# EAGLE design SpectraPCB (EAGLE 8.1.0)
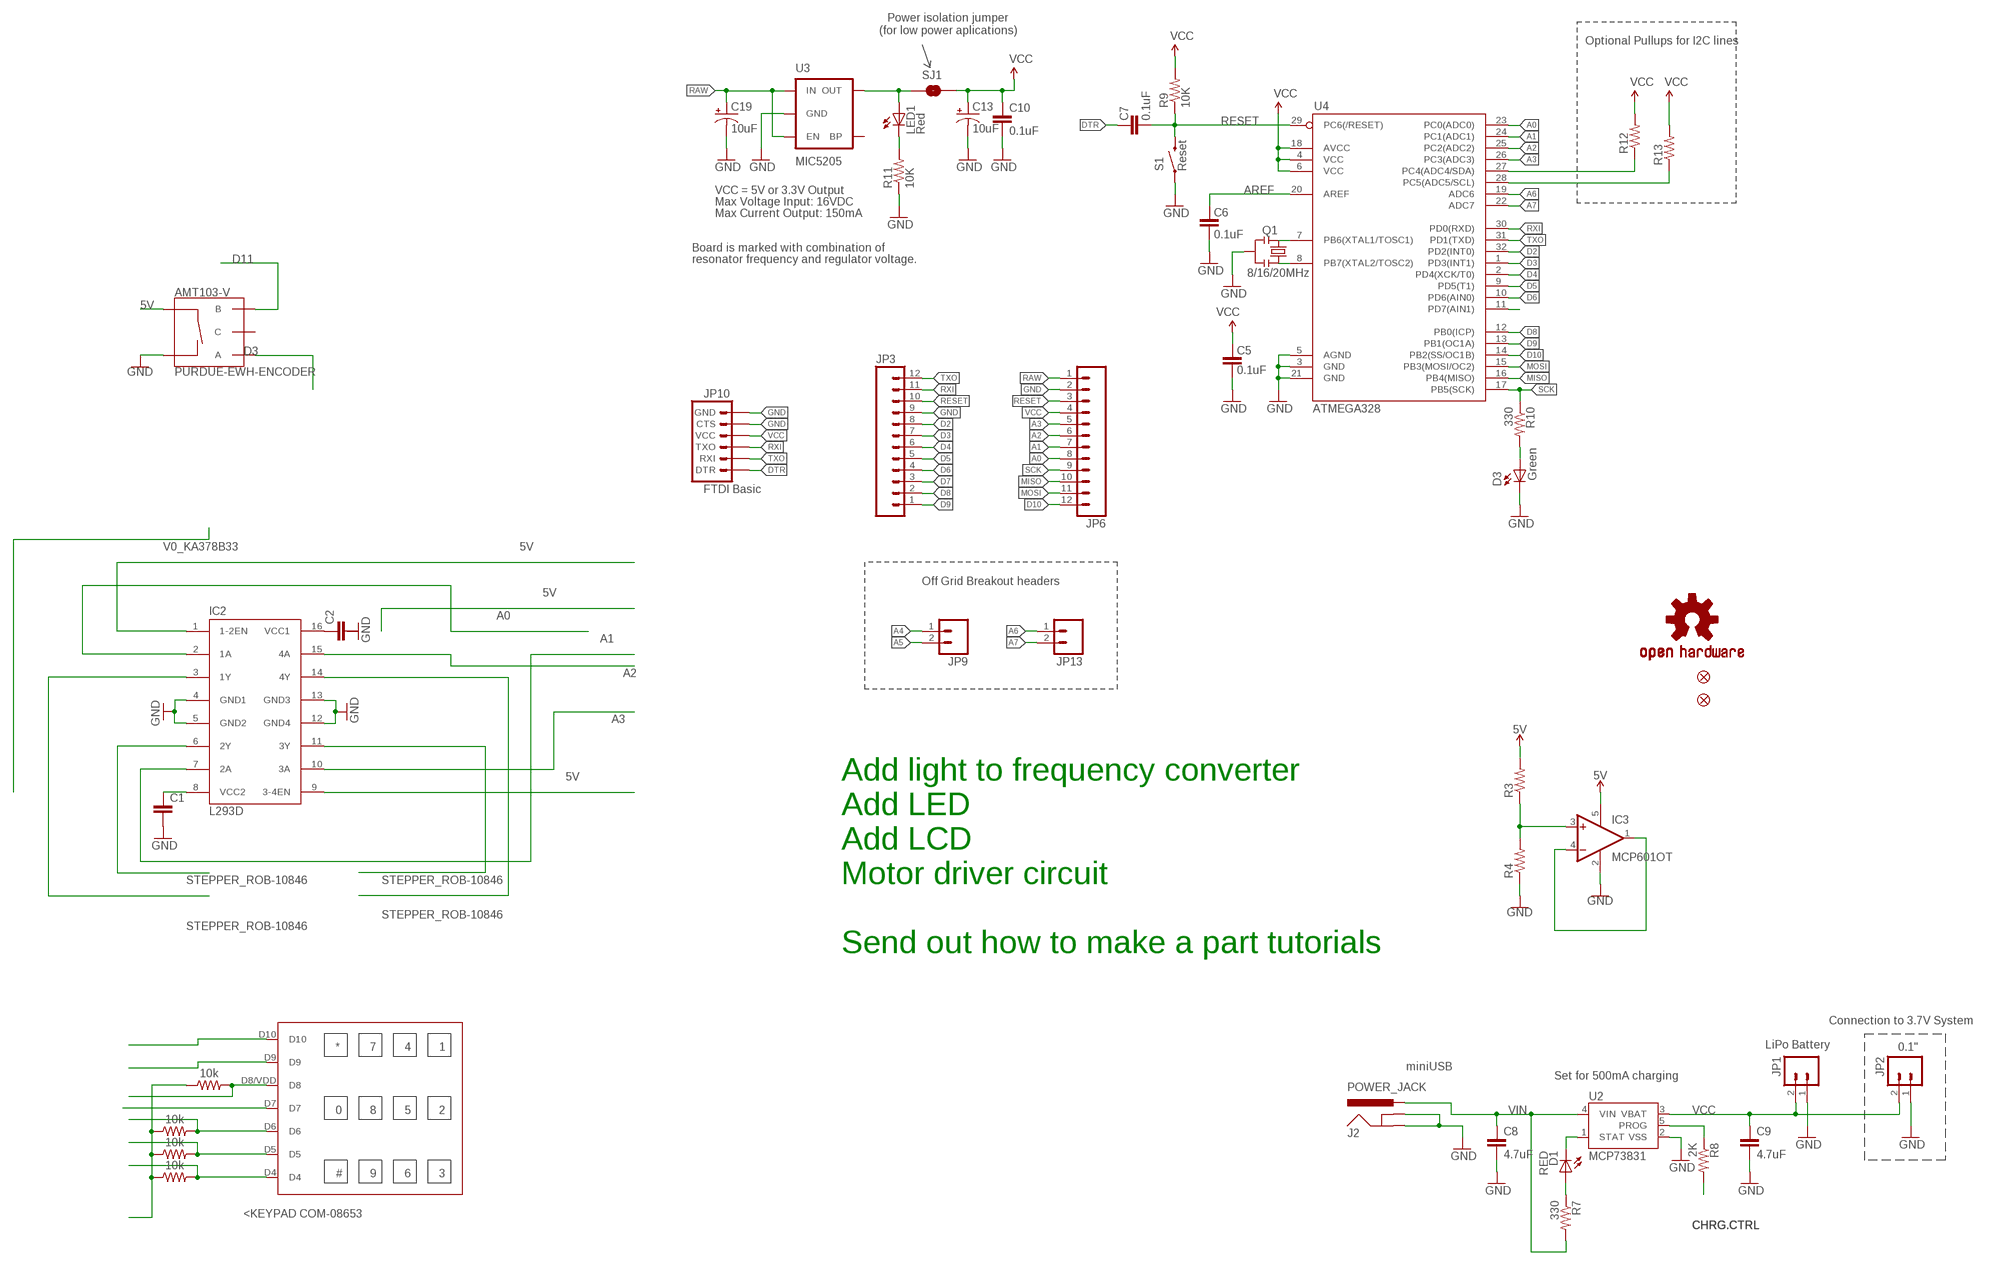
[diagram p0: schematic, sheet 1]

## Parts
AMT103-V  PURDUE-EWH-ENCODER  [PURDUE-EWH-ENCODER]
C1  C-EUC0603  [C0603]
C2  C-EUC0402  [C0402]
C5  0.1uF  CAP0603-CAP  [0603-CAP]
C6  0.1uF  CAP0603-CAP  [0603-CAP]
C7  0.1uF  CAP0603-CAP  [0603-CAP]
C8  4.7uF  CAP0402-CAP  [0402-CAP]
C9  4.7uF  CAP0402-CAP  [0402-CAP]
C10  0.1uF  CAP0603-CAP  [0603-CAP]
C13  10uF  CAP_POL1206  [EIA3216]
C19  10uF  CAP_POL1206  [EIA3216]
D1  RED  LED0603  [LED-0603]
D3  Green  LED  [0603-LED-ALT1]
IC2  L293D  [DIL16]
IC3  MCP601OT  [SOT23-5]
J2  POWER_JACK  [POWER_JACK_PTH]
JP1  LiPo Battery  M02-JST-2MM-SMT  [JST-2-SMD]
JP2  M02PTH  [1X02]
JP3  M12PTH  [1X12]
JP6  M12PTH  [1X12]
JP9  M02PTH  [1X02]
JP10  FTDI Basic  ARDUINO_SERIAL_PROGRAMPTH  [1X06]
JP11  FIDUCIALUFIDUCIAL  [MICRO-FIDUCIAL]
JP12  FIDUCIALUFIDUCIAL  [MICRO-FIDUCIAL]
JP13  M02PTH  [1X02]
LED1  Red  LED  [0603-LED-ALT1]
Q1  8/16/20MHz  RESONATOR1:1  [RESONATOR-SMD-1:1]
R1  10k  10KOHM-0603-1/10W-1%  [0603]
R2  10k  10KOHM-0603-1/10W-1%  [0603]
R3  R-US_R0402  [R0402]
R4  R-US_R0402  [R0402]
R5  10k  10KOHM-0603-1/10W-1%  [0603]
R6  10k  10KOHM-0603-1/10W-1%  [0603]
R7  330  RESISTOR0402-RES  [0402-RES]
R8  2K  RESISTOR0402-RES  [0402-RES]
R9  10K  RESISTOR0603-RES  [0603-RES]
R10  330  RESISTOR0603-RES  [0603-RES]
R11  10K  RESISTOR0603-RES  [0603-RES]
R12  RESISTOR0603-RES  [0603-RES]
R13  RESISTOR0603-RES  [0603-RES]
S1  Reset  SWITCH-MOMENTARY-2SMD-ALT01  [TACTILE-SWITCH-SMD-ALT01]
SJ1  SOLDERJUMPERNC  [SJ_2S]
U2  MCP73831  [SOT23-5]
U3  MIC5205  V_REG_LDOSMD  [SOT23-5]
U4  ATMEGA328  ATMEGA168  [TQFP32-08]
U$1  EWH_KEYPAD  [EWH_KEYPAD]
U$3  OSHW-LOGOS  [OSHW-LOGO-S]

## Nets
5V: AMT103-V.SW+ IC2.1(1-2EN) IC2.9(3-4EN) IC3.5(V+) R3.2
A0: IC2.2(1A) JP6.8 U4.23(PC0(ADC0))
A1: IC2.7(2A) JP6.7 U4.24(PC1(ADC1))
A2: IC2.15(4A) JP6.6 U4.25(PC2(ADC2))
A3: IC2.10(3A) JP6.5 U4.26(PC3(ADC3))
A4: JP9.1 R12.1 U4.27(PC4(ADC4/SDA))
A5: JP9.2 R13.1 U4.28(PC5(ADC5/SCL))
A6: JP13.1 U4.19(ADC6)
A7: JP13.2 U4.22(ADC7)
AREF: C6.2 U4.20(AREF)
CHRG.CTRL: R8.2 U4.11(PD7(AIN1))
D2: JP3.8 U4.32(PD2(INT0))
D3: AMT103-V.A JP3.7 U4.1(PD3(INT1))
D4: JP3.6 U4.2(PD4(XCK/T0))
D5: JP3.5 U4.9(PD5(T1))
D6: JP3.4 U4.10(PD6(AIN0))
D7: JP3.3
D8: JP3.2 U4.12(PB0(ICP))
D9: JP3.1 U4.13(PB1(OC1A))
D10: JP6.12 U4.14(PB2(SS/OC1B))
D11: AMT103-V.B
DTR: C7.2 JP10.1(DTR)
GND: AMT103-V.SW- C1.2 C5.1 C6.1 C8.2 C9.2 C10.2 C13.C(-) C19.C(-) D3.C IC2.4(GND1) IC2.5(GND2) IC2.12(GND4) IC2.13(GND3) IC3.2(V-) J2.GND J2.GNDBREAK JP1.1 JP2.1 JP3.9 JP6.2 JP10.5(CTS) JP10.6(GND) Q1.2 R4.1 R11.1 S1.1 S1.2 U2.2(VSS) U3.2(GND) U4.3(GND) U4.5(AGND) U4.21(GND)
MISO: JP6.10 U4.16(PB4(MISO))
MOSI: JP6.11 U4.15(PB3(MOSI/OC2))
N$1: Q1.3 U4.8(PB7(XTAL2/TOSC2))
N$2: C1.1 IC2.8(VCC2)
N$3: IC3.3(+IN) R3.1 R4.2
N$4: Q1.1 U4.7(PB6(XTAL1/TOSC1))
N$5: LED1.A SJ1.1 U3.5(OUT)
N$6: LED1.C R11.2
N$7: D3.A R10.2
N$8: C2.1 IC2.16(VCC1)
N$9: U$1.D10
N$10: U$1.D9
N$11: R1.2 U$1.D8/VDD(D8)
N$12: U$1.D7
N$13: R2.2 U$1.D6
N$14: R6.2 U$1.D4
N$15: R1.1 R2.1 R5.1 R6.1
N$16: R5.2 U$1.D5
N$17: D1.A R7.1
N$18: IC3.1(OUT) IC3.4(-IN)
PROG1: R8.1 U2.5(PROG)
RAW [vcc]: C19.A(+) JP6.1 U3.1(IN) U3.3(EN)
RESET: C7.1 JP3.10 JP6.3 R9.1 S1.3 S1.4 U4.29(PC6(/RESET))
RXI: JP3.11 JP10.3(TXO) U4.30(PD0(RXD))
SCK: JP6.9 R10.1 U4.17(PB5(SCK))
STAT1: D1.C U2.1(STAT)
STEPPER_ROB-10846: IC2.3(1Y) IC2.6(2Y) IC2.11(3Y) IC2.14(4Y)
TXO: JP3.12 JP10.2(RXI) U4.31(PD1(TXD))
VCC: C5.2 C9.1 C10.1 C13.A(+) JP1.2 JP2.2 JP6.4 JP10.4(VCC) R9.2 R12.2 R13.2 SJ1.2 U2.3(VBAT) U4.4(VCC) U4.6(VCC) U4.18(AVCC)
VIN: C8.1 J2.PWR R7.2 U2.4(VIN)
Unconnected: AMT103-V.C C2.2 U3.4(BP)

## Notes on the sheet
- Power isolation jumper
- (for low power aplications)
- Optional Pullups for I2C lines
- VCC = 5V or 3.3V Output
- Max Voltage Input: 16VDC
- Max Current Output: 150mA
- Board is marked with combination of
- resonator frequency and regulator voltage.
- Off Grid Breakout headers
- Add light to frequency converter
  Add LED
  Add LCD
  Motor driver circuit
  
  Send out how to make a part tutorials
- Connection to 3.7V System
- * | 7 | 4 | 1 | 0.1"
- miniUSB
- Set for 500mA charging
- 0 | 8 | 5 | 2
- # | 9 | 6 | 3
- <KEYPAD COM-08653

## Library data of the parts
AMT103-V = Purdue-EWH-Encoder:PURDUE-EWH-ENCODER: Rotary Encoder w/ Select Switch Encoders rotate similarly to potentiometers, but they’re different from potentiometers in that an encoder has full rotation without limits. They output gray code so that you can tell how much and in which direction the encoder has been turned. This encoder includes a push-down select switch built into the shaft. SparkFun Products Rotary Encoder <https://www.sparkfun.com/products/9117> (COM-09117); SF_SKU: COM-09117
C1 C2 = resistor:C-EU: CAPACITOR, European symbol
C5-C10 = SparkFun:CAP: Capacitor Standard 0603 ceramic capacitor, and 0.1" leaded capacitor.
C13 C19 = SparkFun:CAP_POL: Capacitor Polarized These are standard SMD and PTH capacitors. Normally 10uF, 47uF, and 100uF in electrolytic and tantalum varieties. Always verify the external diameter of the through hole cap, it varies with capacity, voltage, and manufacturer. The EIA devices should be standard.
D1 = SparkFun:LED: LEDs Standard schematic elements and footprints for 5mm, 3mm, 1206, and 0603 sized LEDs. 5mm - Spark Fun Electronics SKU : COM-00529 (and others)
D3 LED1 = Testing:LED: LEDs Standard schematic elements and footprints for 5mm, 3mm, 1206, and 0603 sized LEDs. 5mm - Spark Fun Electronics SKU : COM-00529 (and others)
IC2 = st-microelectronics:L293D: PUSH-PULL 4 CHANNEL DRIVER; MPN: L293D; OC_FARNELL: 9589619; OC_NEWARK: 56P8249
IC3 = CalvEngIO-AnalogIC:MCP601: Single Op Amp 2.7V to 6.0V Single Supply CMOS Source: http://ww1.microchip.com/downloads/en/DeviceDoc/21314g.pdf
J2 = SparkFun-Connectors:POWER_JACK: Power Jack Connector This is the standard 5.5mm barrel jack for power. The PTH is the most common, proven, reliable, footprint. The Slot footprint only works if the mill layer is transmitted to the PCB fab house so be warned. Here are the connectors we sell at SparkFun: DC Barrel Power Jack/Connector <https://www.sparkfun.com/products/119> (PRT-00119) DC Barrel Power Jack/Connector (SMD) <https://www.sparkfun.com/products/12748> (PRT-12748) DC Barrel Jack Adapter - Breadboard Compatible <https://www.sparkfun.com/products/10811> (PRT-10811) It is used on this SparkFun product (and many, many others): SparkFun RedBoard - Programmed with Arduino <https://www.sparkfun.com/products/12757> (DEV-12757) Also, if you need a mating power supply or connector, please check these out: Wall Adapter Power Supply - 9VDC 650mA <https://www.sparkfun.com/products/298> (TOL-00298) DC Barrel Jack Adapter - Male <https://www.sparkfun.com/products/10287> (PRT-10287); PROD_ID: CONN-08197
JP1 JP2 JP9 JP13 = SparkFun:M02: Header 2 Standard 2-pin 0.1" header. Use with straight break away headers (SKU : PRT-00116), right angle break away headers (PRT-00553), swiss pins (PRT-00743), machine pins (PRT-00117), and female headers (PRT-00115). Molex polarized connector foot print use with SKU : PRT-08233 with associated crimp pins and housings.
JP3 JP6 = SparkFun:M12: Header 12 Standard 12-pin 0.1" header. Use with straight break away headers (SKU : PRT-00116), right angle break away headers (PRT-00553), swiss pins (PRT-00743), machine pins (PRT-00117), and female headers (PRT-00115).
JP10 = SparkFun:ARDUINO_SERIAL_PROGRAM
JP11 JP12 = SparkFun:FIDUCIAL: Fiducial Alignment Points Various fiducial points for machine vision alignment.
Q1 = Testing:RESONATOR: Resonator Small SMD resonator. This is the itty bitty 10/20MHz resonators with built in caps. CSTCE10M0G55 and CSTCE20M0V53. Footprint for SMD has been used in SFE production for years, and does work okay. 1:1 is an attempt to get larger fillets on the sides so it will be easier to inspect these solders in our AOI machine. The pads have been minimized to match the actual metal under the resonator. To see this relation, it includes an image import of the bottom side of the component. Imported to scale on layer 200.
R1 R2 R5 R6 = SparkFun-Resistors:10KOHM: 10kΩ resistor A resistor is a passive two-terminal electrical component that implements electrical resistance as a circuit element. Resistors act to reduce current flow, and, at the same time, act to lower voltage levels within circuits. - Wikipedia; PROD_ID: RES-00824
R3 R4 = resistor:R-US_: RESISTOR, American symbol
R7-R13 = SparkFun:RESISTOR: Resistor Basic schematic elements and footprints for 0603, 1206, and PTH resistors.
S1 = Testing:SWITCH-MOMENTARY-2: Various NO switches- pushbuttons, reed, etc
SJ1 = SparkFun-Passives:SOLDERJUMPER: Solder Jumper Standard SMD solder jumper. Used to automate production. Two varients : Normally Open and Normally Closed are the same, but have different paste layers. NC will have a large amount of paste and should jumper during reflow.
U2 = SparkFun:MCP73831: Microchip's MCP73831 Miniature single cell, fully integrated Li-Ion, Li-polymer charge management controller http://ww1.microchip.com/downloads/en/DeviceDoc/21984a.pdf
U3 = SparkFun:V_REG_LDO: Voltage Regulator LDO Standard 150mA LDO voltage regulator in SOT-23 layout. Micrel part MIC5205. BP (by-pass) pin is used to lower output noise with 470pF cap.
U4 = SparkFun:ATMEGA168
U$1 = Purdue-EWH-Keypad:EWH_KEYPAD
U$3 = SparkFun:OSHW-LOGO: Open Source Hardware Logo This logo indicates the piece of hardware it is found on incorporates a OSHW license and/or adheres to the definition of open source hardware found here: http://freedomdefined.org/OSHW

## Net classes
1 vcc: width 0.254 mm

## Board
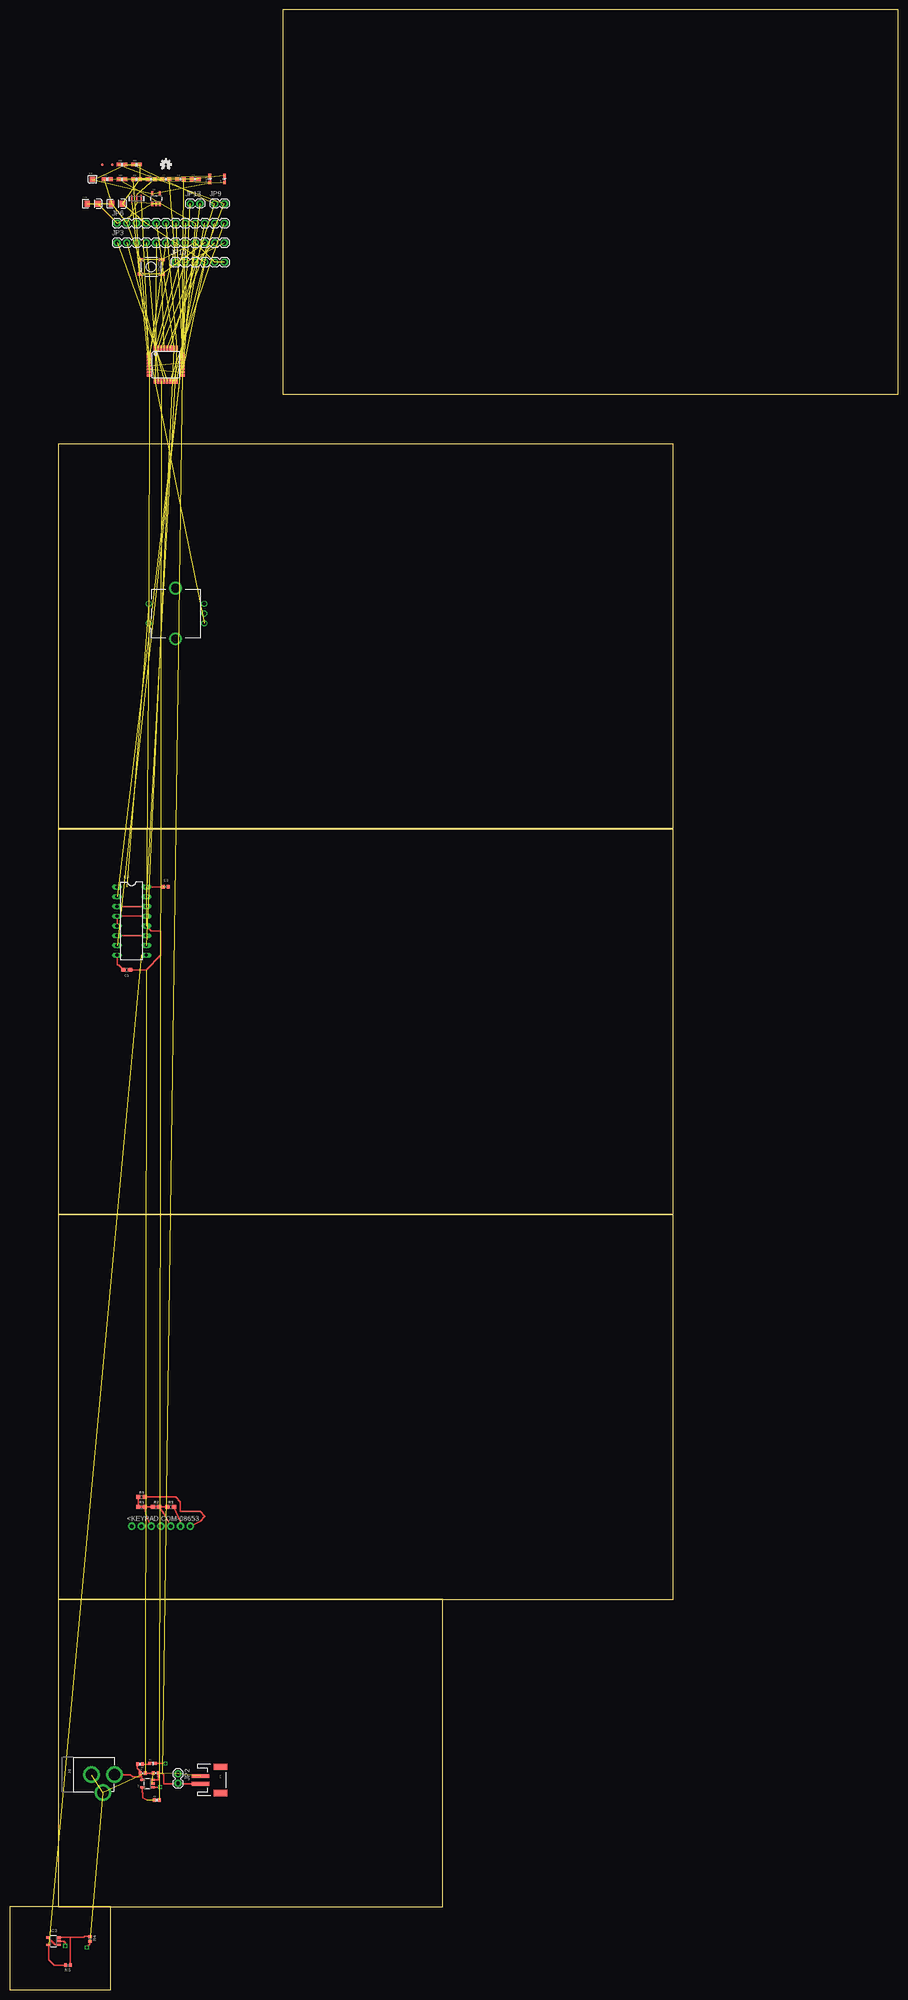
[diagram p1: board, top side]
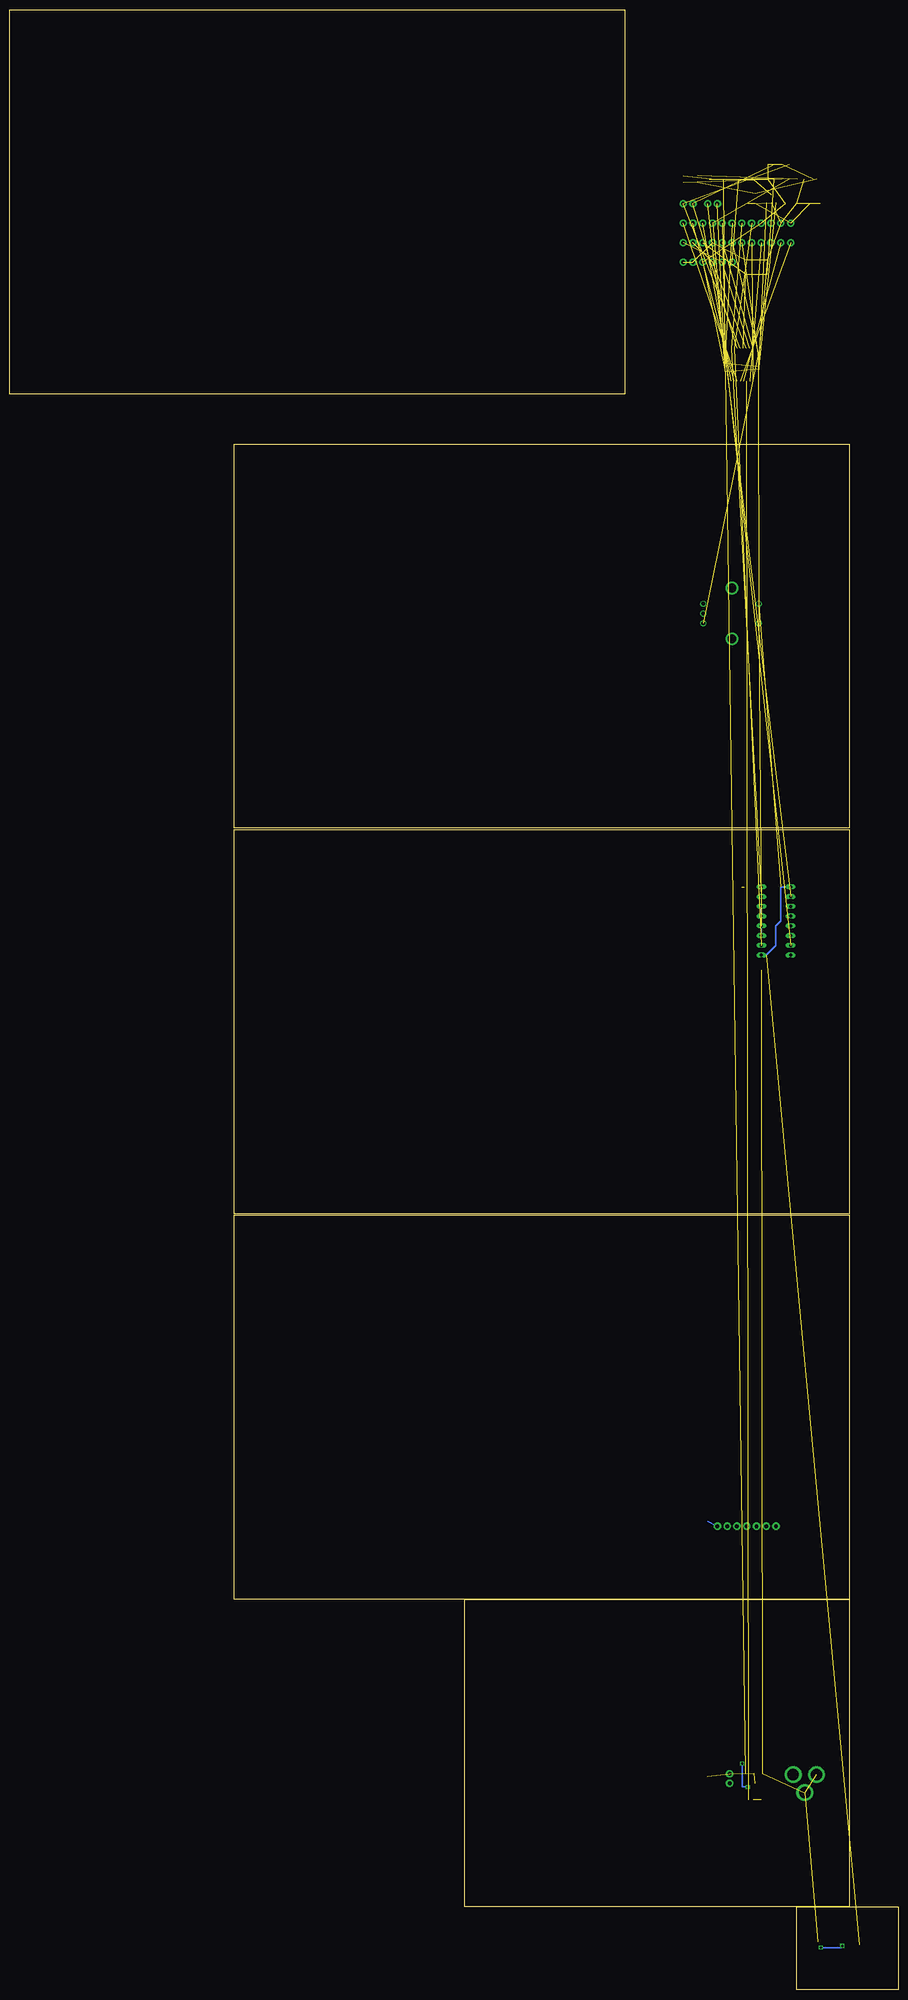
[diagram p2: board, bottom side, seen from below]

Size 231.12 x 515.29 mm. Coordinates in mm from the lower left corner, seen from the top.
Outline: 71.12,415.29 231.12,415.29 231.12,515.29 71.12,515.29 71.12,415.29
Outline: 12.7,302.26 172.7,302.26 172.7,402.26 12.7,402.26 12.7,302.26
Outline: 12.7,201.93 172.7,201.93 172.7,301.93 12.7,301.93 12.7,201.93
Outline: 12.7,101.6 172.7,101.6 172.7,201.6 12.7,201.6 12.7,101.6
Outline: 12.7,21.59 112.7,21.59 112.7,101.59 12.7,101.59 12.7,21.59
Outline: 0,0 26.34,0 26.34,21.58 0,21.58 0,0
Copper layers (1*16): Top 0.035mm / dielectric 1.5mm / Bottom 0.035mm
Design rules "default": minimum track width 10mil, minimum drill 24mil, track to track 8mil, track to pad 8mil, pad to pad 8mil, via to via 8mil, smd to smd 8mil, copper to edge 40mil, drill to drill 8mil, minimum pad ring 10mil, minimum via ring 8mil, stop-mask expansion 4mil, vias tented up to drill 0mil, thermal gap 10mil

### Footprints (pad centres in the part's own frame; a part is rotated, then mirrored left to right if it is on the bottom)
PURDUE-EWH-ENCODER = drill 1.016: A 7.493,-2.54; B 7.493,2.54; C 7.493,0; SW+ -6.985,2.54; SW- -6.985,-2.54 | drill 2.286: P$3 0,6.604; P$4 0,-6.604
C0603 = smd 1.1 x 1: 1 -0.85,0; 2 0.85,0
C0402 = smd 0.7 x 0.9: 1 -0.65,0; 2 0.65,0
0603-CAP = smd 1.1 x 1: 1 -0.85,0; 2 0.85,0
0402-CAP = smd 0.7 x 0.9: 1 -0.65,0; 2 0.65,0
EIA3216 = smd 1.4 x 1.6: A 1.4,0; C -1.4,0
LED-0603 = smd 0.8 x 0.8: A 0,-0.75; C 0,0.75
0603-LED-ALT1 = smd 1 x 1: A 0,-0.877; C 0,0.877
DIL16 = drill 0.813 long: 1 -8.89,-3.81; 2 -6.35,-3.81; 3 -3.81,-3.81; 4 -1.27,-3.81; 5 1.27,-3.81; 6 3.81,-3.81; 7 6.35,-3.81; 8 8.89,-3.81; 9 8.89,3.81; 10 6.35,3.81; 11 3.81,3.81; 12 1.27,3.81; 13 -1.27,3.81; 14 -3.81,3.81; 15 -6.35,3.81; 16 -8.89,3.81
SOT23-5 = smd 0.6 x 1.2: 1 -0.95,-1.306; 2 0,-1.306; 3 0.95,-1.306; 4 0.95,1.306; 5 -0.95,1.306
POWER_JACK_PTH = drill 2.997 pad 4.318: GND 0,7.7; GNDBREAK 4.7,10.7; PWR 0,13.7
JST-2-SMD = smd 1 x 4.6: 1 -1,-3.7; 2 1,-3.7 | smd 1.6 x 3.4: NC1 -3.4,1.5; NC2 3.4,1.5
1X02 = drill 1.016 pad 1.88: 1 0,0; 2 2.54,0
1X12 = drill 1.016 pad 1.88: 1 0,0; 2 2.54,0; 3 5.08,0; 4 7.62,0; 5 10.16,0; 6 12.7,0; 7 15.24,0; 8 17.78,0; 9 20.32,0; 10 22.86,0; 11 25.4,0; 12 27.94,0
1X06 = drill 1.016 pad 1.88: 1 0,0; 2 2.54,0; 3 5.08,0; 4 7.62,0; 5 10.16,0; 6 12.7,0
MICRO-FIDUCIAL = smd 0.635 x 0.635: 1 0,0
RESONATOR-SMD-1:1 = smd 0.45 x 1.905: 1 -1.2,0; 2 0,0; 3 1.2,0
0603 = smd 1.1 x 1: 1 -0.85,0; 2 0.85,0
R0402 = smd 0.7 x 0.9: 1 -0.65,0; 2 0.65,0
0402-RES = smd 0.7 x 0.9: 1 -0.65,0; 2 0.65,0
0603-RES = smd 1.1 x 1: 1 -0.85,0; 2 0.85,0
TACTILE-SWITCH-SMD-ALT01 = smd 1.524 x 0.762: 1 -2.794,1.905; 2 2.794,1.905; 3 -2.794,-1.905; 4 2.794,-1.905
SJ_2S = smd 0.635 x 1.27: 1 -0.412,0; 2 0.412,0
SOT23-5' = smd 0.55 x 1.2: 1 -0.95,-1.3; 2 0,-1.3; 3 0.95,-1.3; 4 0.95,1.3; 5 -0.95,1.3
TQFP32-08 = smd 1.27 x 0.559: 1 -4.293,2.8; 2 -4.293,2; 3 -4.293,1.2; 4 -4.293,0.4; 5 -4.293,-0.4; 6 -4.293,-1.2; 7 -4.293,-2; 8 -4.293,-2.8; 17 4.293,-2.8; 18 4.293,-2; 19 4.293,-1.2; 20 4.293,-0.4; 21 4.293,0.4; 22 4.293,1.2; 23 4.293,2; 24 4.293,2.8 | smd 0.559 x 1.27: 9 -2.8,-4.293; 10 -2,-4.293; 11 -1.2,-4.293; 12 -0.4,-4.293; 13 0.4,-4.293; 14 1.2,-4.293; 15 2,-4.293; 16 2.8,-4.293; 25 2.8,4.293; 26 2,4.293; 27 1.2,4.293; 28 0.4,4.293; 29 -0.4,4.293; 30 -1.2,4.293; 31 -2,4.293; 32 -2.8,4.293
EWH_KEYPAD = drill 1.016 pad 1.88: D4 7.62,0; D5 5.08,0; D6 2.54,0; D7 0,0; D8/VDD -2.54,0; D9 -5.08,0; D10 -7.62,0

### Placement (x,y rotation side)
AMT103-V  43.18,358.14 0 top
C1  30.48,265.43 0 top
C2  40.64,287.02 0 top
C5  48.26,471.17 0 top
C6  44.45,471.17 0 top
C7  40.64,471.17 0 top
C8  34.65,56.39 0 top
C9  38.02,56.41 180 top
C10  36.83,471.17 0 top
C13  27.94,464.82 0 top
C19  21.59,464.82 0 top
D1  37.19,58.95 270 top
D3  55.88,471.17 0 top
IC2  31.75,278.13 270 top
IC3  11.43,12.7 90 top
J2  13.56,56.03 270 top
JP1  53.37,54.64 270 top
JP2  43.82,56.26 270 top
JP3  27.94,454.66 0 top
JP6  27.94,459.74 0 top
JP9  53.34,464.82 0 top
JP10  43.18,449.58 0 top
JP11  26.67,474.98 0 top
JP12  24.13,474.98 0 top
JP13  46.99,464.82 0 top
LED1  52.07,471.17 0 top
Q1  33.02,466.09 0 top
R1  34.29,125.73 0 top
R2  38.1,125.73 0 top
R3  15.19,6.43 180 top
R4  20.88,13.23 90 top
R5  41.91,125.73 0 top
R6  34.29,128.27 0 top
R7  33.93,58.75 180 top
R8  38.28,49.4 0 top
R9  33.02,471.17 0 top
R10  29.21,471.17 0 top
R11  25.4,471.17 0 top
R12  33.02,474.98 0 top
R13  29.21,474.98 0 top
S1  36.83,448.31 0 top
SJ1  21.59,471.17 0 top
U2  MCP73831  [SOT23-5']  35.84,53.7 90 top
U3  MIC5205  [SOT23-5']  38.1,466.09 0 top
U4  40.64,422.91 0 top
U$1  39.37,120.65 0 top
U$3  40.64,474.98 0 top

### Tracks (layer width: path | path; a pad name or v marks a point on that pad's centre or on a via)
5V  (2 unrouted)
  Top 0.406: IC3.5 10.12,7.89 11.61,6.4 14.51,6.4 R3.2
  Bottom 0.406: IC2.9 34.29,269.24 31.75,271.78 31.75,276.86 30.48,278.13 30.48,287.02 IC2.1
A0  (2 unrouted)
A1  (2 unrouted)
A2  (2 unrouted)
A3  (2 unrouted)
A4  (2 unrouted)
A5  (2 unrouted)
A6  (1 unrouted)
A7  (1 unrouted)
AREF  (1 unrouted)
CHRG.CTRL  (1 unrouted)
D2  (1 unrouted)
D3  (2 unrouted)
D4  (1 unrouted)
D5  (1 unrouted)
D6  (1 unrouted)
D8  (1 unrouted)
D9  (1 unrouted)
D10  (1 unrouted)
DTR  (1 unrouted)
GND  (via drill 0.6)  (27 unrouted)
  Top 0.406: IC2.5 IC2.4 IC2.13 | C1.2 35.56,265.43 39.37,269.24 39.37,275.59 36.83,275.59 IC2.12 | C8.2 37.35,56.39 C9.2 | R4.1 20.88,11.84 v20.07,11.02 | v14.48,11.46 14.48,12.24 14.02,12.7 IC3.2
  Bottom 0.406: v20.07,11.02 14.91,11.02 v14.48,11.46
MISO  (1 unrouted)
MOSI  (1 unrouted)
N$1  (1 unrouted)
N$2
  Top 0.406: IC2.8 27.94,266.7 28.36,266.7 C1.1
N$3
  Top 0.406: 15.95,13.65 IC3.3 | 15.95,13.65 19.31,13.65 19.58,13.92 20.84,13.92 R4.2 | R3.1 15.84,13.54 15.95,13.65
N$4  (1 unrouted)
N$5  (2 unrouted)
N$6  (1 unrouted)
N$7  (1 unrouted)
N$8  (1 unrouted)
  Top 0.406: IC2.16 40.64,287.02
N$11
  Top 0.406: R1.2 35.56,123.19 U$1.D8/VDD
N$13
  Top 0.406: R2.2 40.64,123.19 U$1.D6
N$14
  Top 0.406: R6.2 43.18,128.27 44.45,127 44.45,124.46 49.53,124.46 50.8,123.19 49.53,121.92 U$1.D4
  Bottom 0.406: U$1.D4 49.53,121.92
N$15
  Top 0.406: R6.1 R1.1 R2.1 R5.1
N$16
  Top 0.406: R5.2 44.45,121.92 U$1.D5
N$17
  Top 0.406: R7.1 36.23,58.75 D1.A
N$18
  Top 0.406: IC3.4 10.12,13.47 11.89,11.71 12.7,11.71 IC3.1
PROG1  (1 unrouted)
  Top 0.406: U2.5 34.59,50.03 35.64,49.43
RAW  (3 unrouted)
RESET  (6 unrouted)
RXI  (2 unrouted)
SCK  (2 unrouted)
STAT1  (via drill 0.6)
  Top 0.406: 37.38,52.76 U2.1 39,52.75 39.07,52.68 39.07,52.73 v39.12,52.78 | v40.54,58.9 37.99,58.9 D1.C
  Bottom 0.406: v39.12,52.78 40.49,52.78 40.59,52.88 40.59,58.85 v40.54,58.9 | v40.54,58.9 40.46,58.98 v40.54,58.9
STEPPER_ROB-10846
  Top 0.406: IC2.3 IC2.14 | IC2.6 IC2.11
  Bottom 0.406: IC2.14 IC2.11
TXO  (2 unrouted)
VCC  (12 unrouted)
  Top 0.406: U2.3 37.18,54.61 38.79,54.61 38.67,54.72 C9.1 39.7,56.41 40.16,55.96 40.16,53.65 40.18,53.62 43.71,53.62 JP2.2 | JP2.2 43.76,53.77 | JP1.2 43.9,53.64 JP2.2
VIN
  Top 0.406: 34.35,54.46 U2.4 34.54,54.8 34.33,55.42 | 34.33,55.42 C8.1 34,56.89 33.17,57.71 33.17,58.64 R7.2 | J2.PWR 31.45,56.03 32.08,55.4 34.3,55.4 34.33,55.42